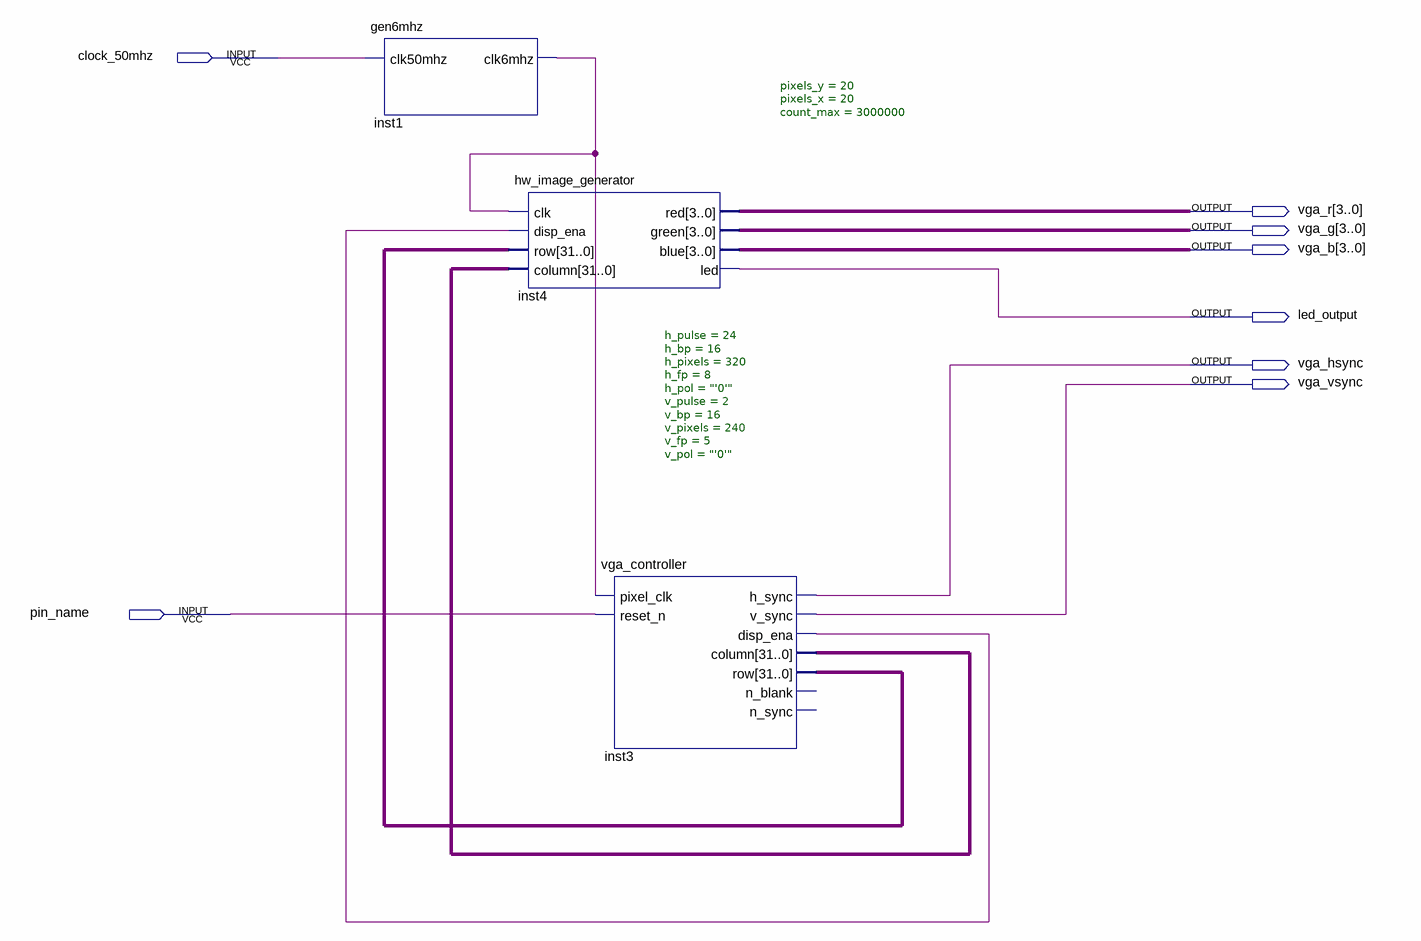
[diagram p0: schematic sheet]
// Quartus schematic top_de1.bdf as structural Verilog: 3 symbols, 8 pins
module top_de1 (
  input  clock_50mhz,
  input  pin_name,
  output [3:0] vga_r,
  output [3:0] vga_g,
  output [3:0] vga_b,
  output led_output,
  output vga_hsync,
  output vga_vsync
);

  wire inst1_clk6mhz, inst3_disp_ena;
  wire [31:0] inst3_column, inst3_row;

  gen6mhz inst1 (.clk50mhz(clock_50mhz), .clk6mhz(inst1_clk6mhz));
  hw_image_generator #(.pixels_y(20), .pixels_x(20), .count_max(3000000)) inst4 (
    .clk(inst1_clk6mhz), .disp_ena(inst3_disp_ena), .row(inst3_row), .column(inst3_column), .red(vga_r),
    .green(vga_g), .blue(vga_b), .led(led_output));
  vga_controller #(.h_pulse(24), .h_bp(16), .h_pixels(320), .h_fp(8), .h_pol("'0'"), .v_pulse(2), .v_bp(16), .v_pixels(240), .v_fp(5), .v_pol("'0'")) inst3 (
    .pixel_clk(inst1_clk6mhz), .reset_n(pin_name), .h_sync(vga_hsync), .v_sync(vga_vsync),
    .disp_ena(inst3_disp_ena), .column(inst3_column), .row(inst3_row));  // open: n_blank, n_sync
endmodule
